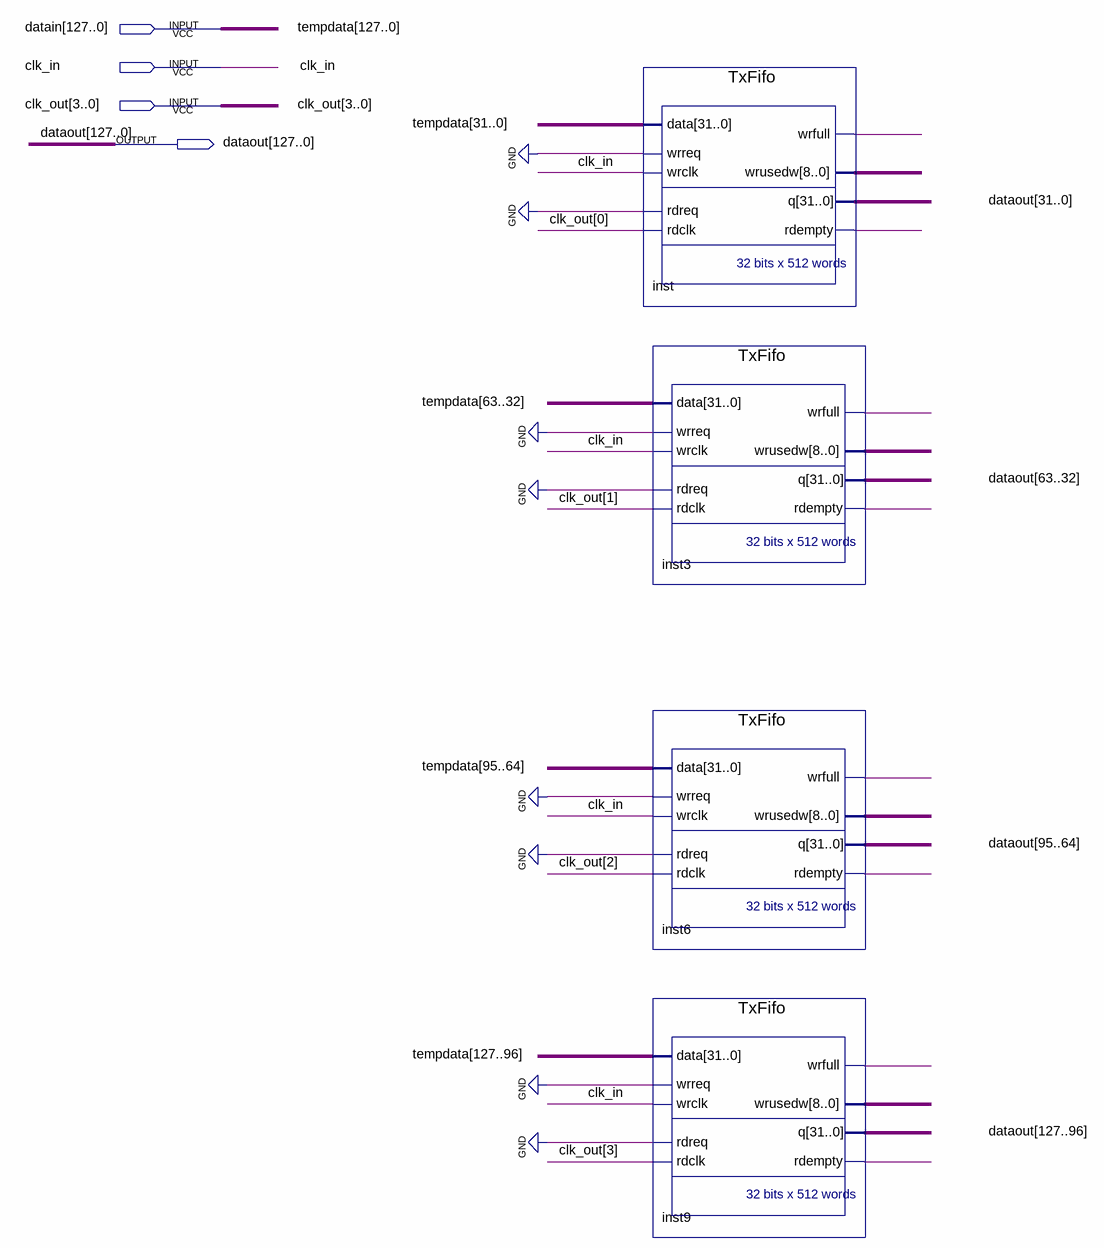
[diagram p0: schematic sheet]
// Quartus schematic TxFifos_4chan.bdf as structural Verilog: 4 symbols, 4 pins
module TxFifos_4chan (
  input  [127:0] datain,
  input  clk_in,
  input  [3:0] clk_out,
  output [127:0] dataout
);

  wire inst3_rdempty, inst3_wrfull, inst6_rdempty, inst6_wrfull, inst9_rdempty, inst9_wrfull, inst_rdempty,
       inst_wrfull;
  wire [8:0] inst3_wrusedw, inst6_wrusedw, inst9_wrusedw, inst_wrusedw;

  TxFifo inst (
    .data(datain[31:0]), .wrreq(1'b0), .wrclk(clk_in), .rdreq(1'b0), .rdclk(clk_out[0]),
    .wrfull(inst_wrfull), .wrusedw(inst_wrusedw), .q(dataout[31:0]), .rdempty(inst_rdempty));
  TxFifo inst3 (
    .data(datain[63:32]), .wrreq(1'b0), .wrclk(clk_in), .rdreq(1'b0), .rdclk(clk_out[1]),
    .wrfull(inst3_wrfull), .wrusedw(inst3_wrusedw), .q(dataout[63:32]), .rdempty(inst3_rdempty));
  TxFifo inst6 (
    .data(datain[95:64]), .wrreq(1'b0), .wrclk(clk_in), .rdreq(1'b0), .rdclk(clk_out[2]),
    .wrfull(inst6_wrfull), .wrusedw(inst6_wrusedw), .q(dataout[95:64]), .rdempty(inst6_rdempty));
  TxFifo inst9 (
    .data(datain[127:96]), .wrreq(1'b0), .wrclk(clk_in), .rdreq(1'b0), .rdclk(clk_out[3]),
    .wrfull(inst9_wrfull), .wrusedw(inst9_wrusedw), .q(dataout[127:96]), .rdempty(inst9_rdempty));

  // Other names for the same wires on the sheet: tempdata[127:0] = datain
endmodule
